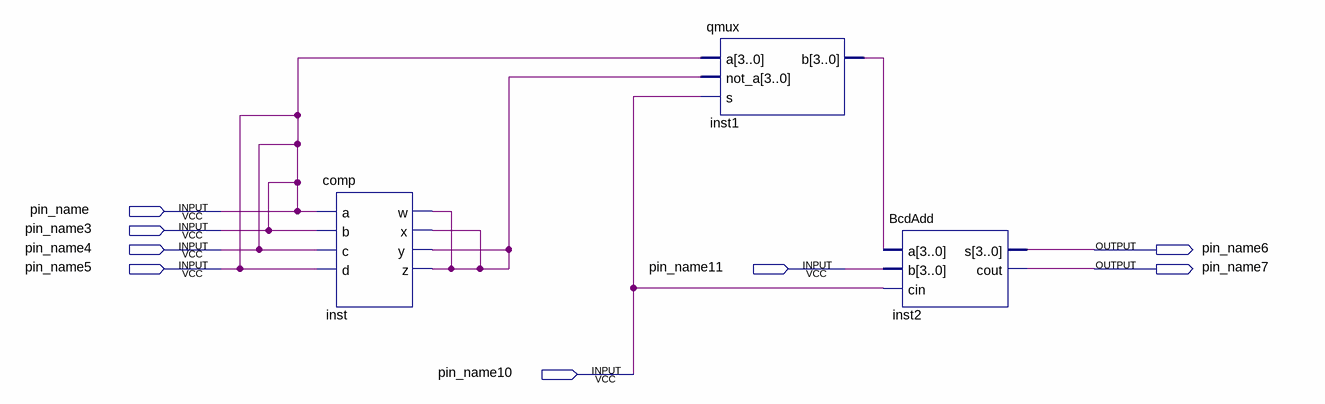
[diagram p0: schematic sheet]
// Quartus schematic design.bdf as structural Verilog: 3 symbols, 8 pins
module \design  (
  input  pin_name,
  input  pin_name3,
  input  pin_name4,
  input  pin_name5,
  input  pin_name11,
  input  pin_name10,
  output pin_name6,
  output pin_name7
);

  wire inst_w;
  wire [3:0] inst1_b;

  comp inst (.a(pin_name), .b(pin_name), .c(pin_name), .d(pin_name), .w(inst_w), .x(inst_w), .y(inst_w), .z(inst_w));
  qmux inst1 (.a({4{pin_name}}), .not_a({4{inst_w}}), .s(pin_name10), .b(inst1_b));
  BcdAdd inst2 (.a(inst1_b), .b({4{pin_name11}}), .cin(pin_name10), .s(pin_name6), .cout(pin_name7));

  assign pin_name3 = pin_name;
  assign pin_name4 = pin_name;
  assign pin_name5 = pin_name;
endmodule
